# EAGLE design CFA_T_4L (EAGLE 9.4.2)
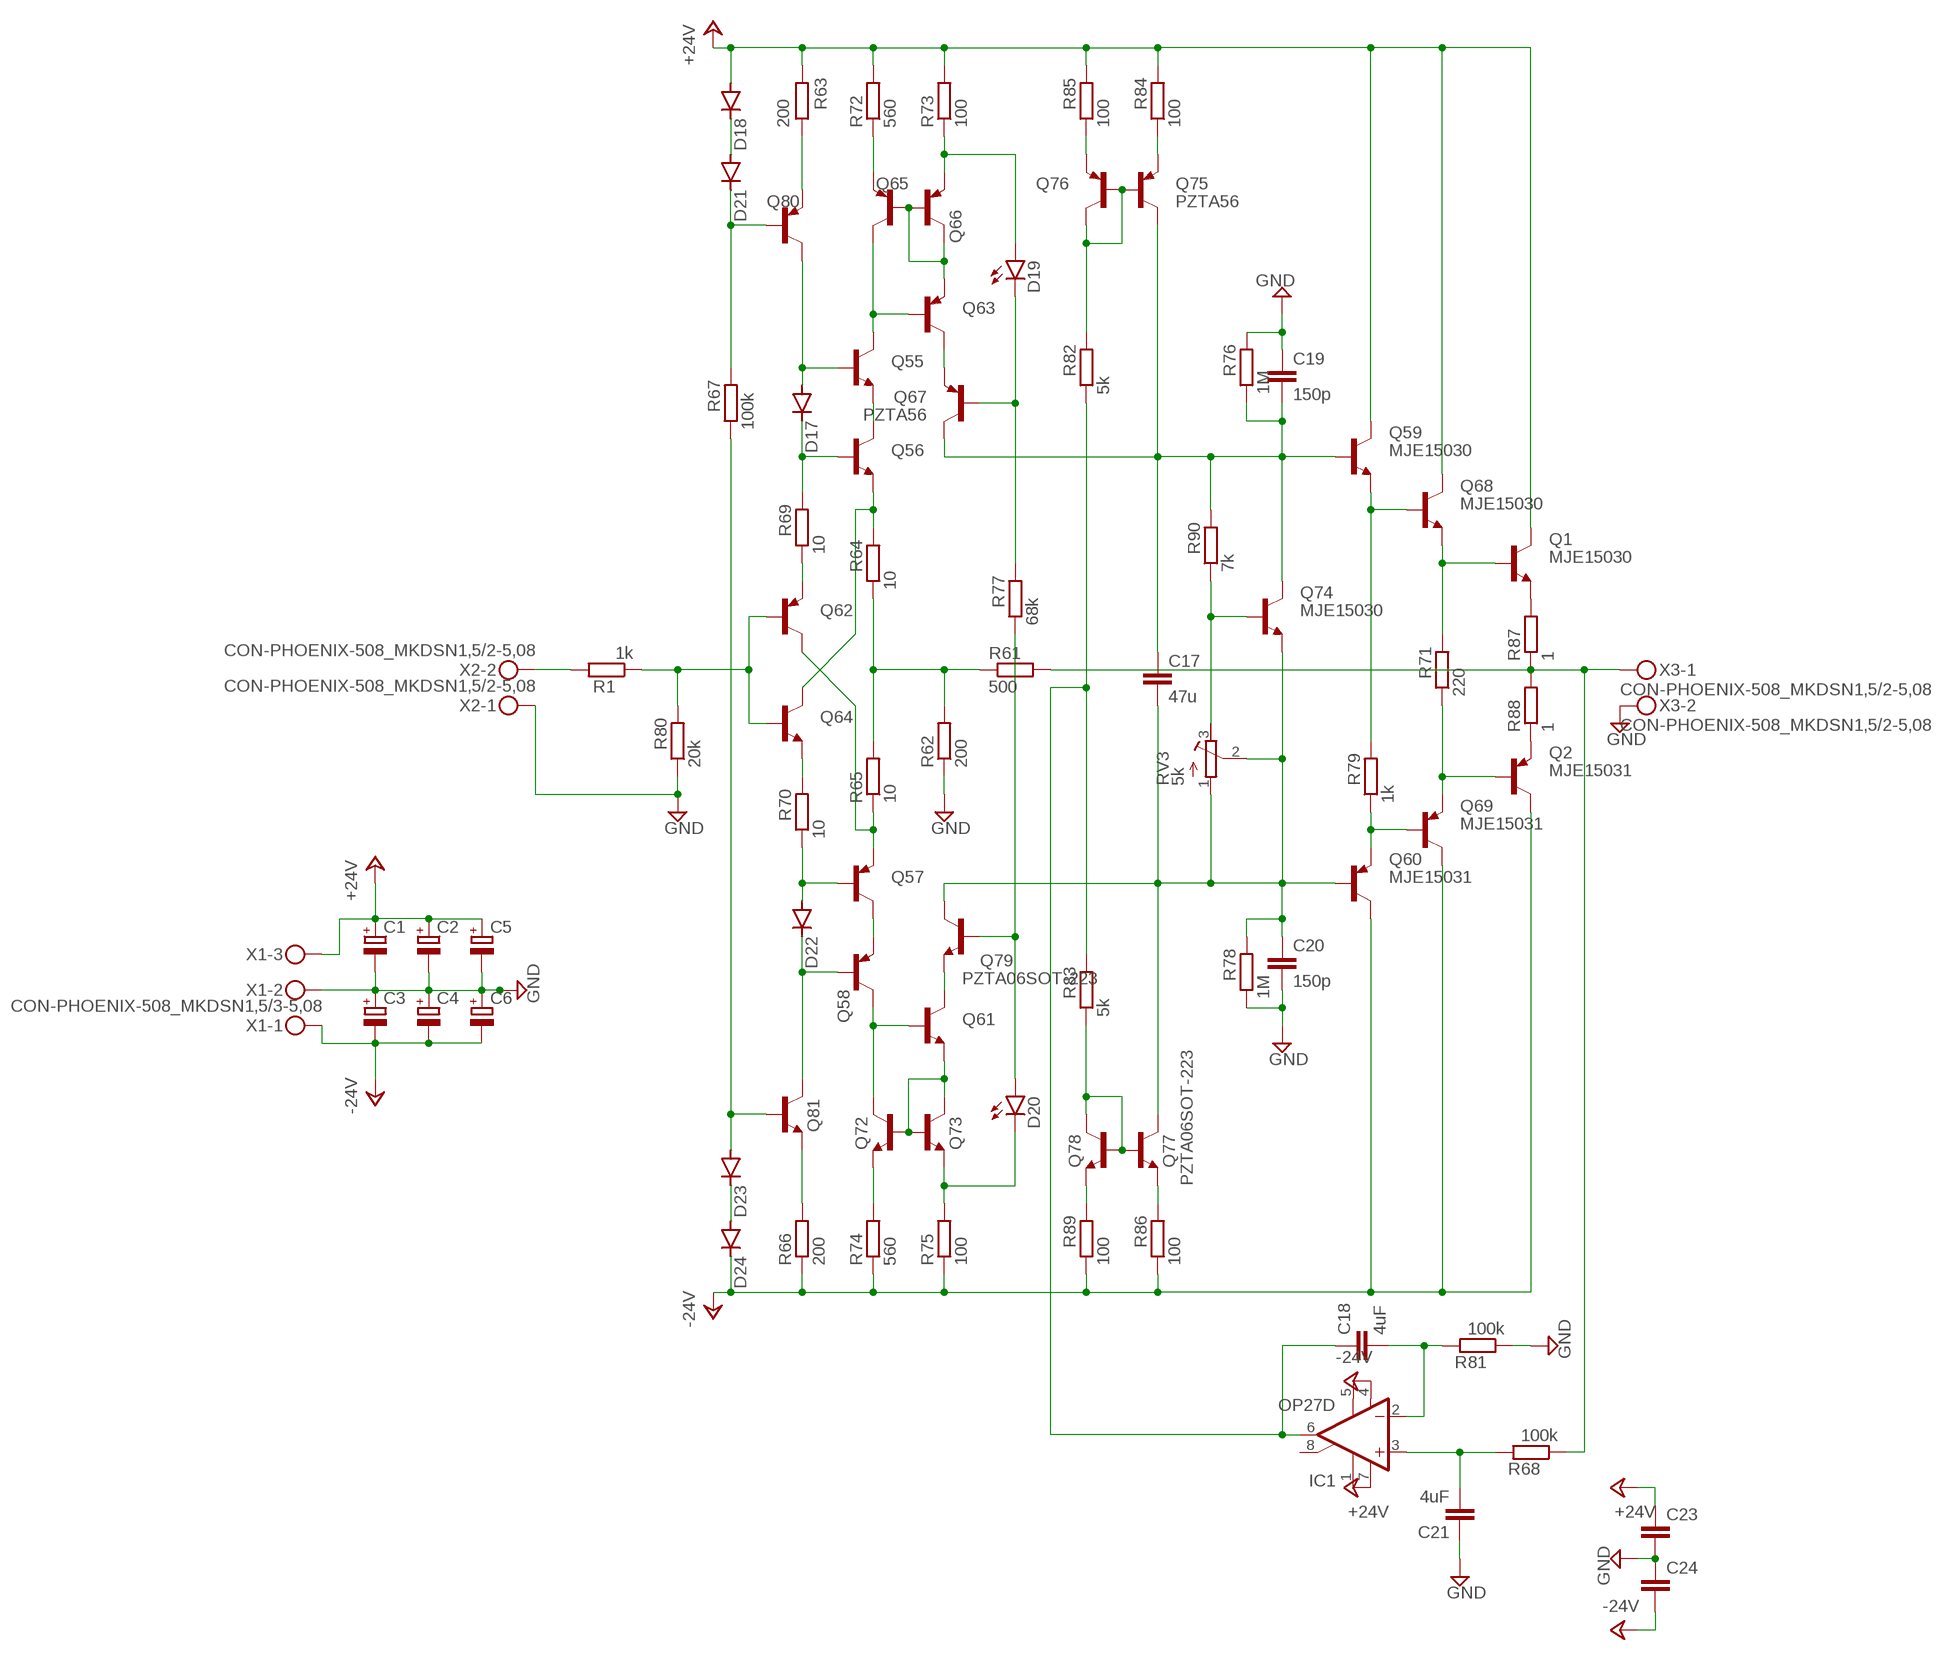
[diagram p0: schematic, sheet 1]

## Parts
C1  CPOL-EUE3.5-8  [E3,5-8]
C2  CPOL-EUE3.5-8  [E3,5-8]
C3  CPOL-EUE3.5-8  [E3,5-8]
C4  CPOL-EUE3.5-8  [E3,5-8]
C5  CPOL-EUE3.5-8  [E3,5-8]
C6  CPOL-EUE3.5-8  [E3,5-8]
C17  47u  C-EUC1210  [C1210]
C18  4uF  C-EUC1210  [C1210]
C19  150p  C-EUC0805  [C0805]
C20  150p  C-EUC0805  [C0805]
C21  4uF  C-EUC1210  [C1210]
C23  C-EUC0603K  [C0603K]
C24  C-EUC0603K  [C0603K]
D17  DIODE-SOD80C  [SOD80C]
D18  DIODE-SOD80C  [SOD80C]
D19  LED3MM  [LED3MM]
D20  LED3MM  [LED3MM]
D21  DIODE-SOD80C  [SOD80C]
D22  DIODE-SOD80C  [SOD80C]
D23  DIODE-SOD80C  [SOD80C]
D24  DIODE-SOD80C  [SOD80C]
IC1  OP27D  [SO08]
Q1  MJE15030  TRANSISTOR_MJE15030  [TRANSISTOR_TO220KG]
Q2  MJE15031  TRANSISTOR_MJE15031  [TRANSISTOR_TO220KG]
Q55  TRANSISTOR_BC850-NPN-SOT23-BEC  [TRANSISTOR_SOT23-BEC]
Q56  TRANSISTOR_BC850-NPN-SOT23-BEC  [TRANSISTOR_SOT23-BEC]
Q57  TRANSISTOR_BC857C-PNP-SOT23-BEC  [TRANSISTOR_SOT23-BEC]
Q58  TRANSISTOR_BC857C-PNP-SOT23-BEC  [TRANSISTOR_SOT23-BEC]
Q59  MJE15030  TRANSISTOR_MJE15030  [TRANSISTOR_TO220KG]
Q60  MJE15031  TRANSISTOR_MJE15031  [TRANSISTOR_TO220KG]
Q61  TRANSISTOR_BC847-NPN-SOT23-BEC  [TRANSISTOR_SOT23-BEC]
Q62  TRANSISTOR_BC857C-PNP-SOT23-BEC  [TRANSISTOR_SOT23-BEC]
Q63  TRANSISTOR_BC857C-PNP-SOT23-BEC  [TRANSISTOR_SOT23-BEC]
Q64  TRANSISTOR_BC850-NPN-SOT23-BEC  [TRANSISTOR_SOT23-BEC]
Q65  TRANSISTOR_BC857C-PNP-SOT23-BEC  [TRANSISTOR_SOT23-BEC]
Q66  TRANSISTOR_BC857C-PNP-SOT23-BEC  [TRANSISTOR_SOT23-BEC]
Q67  PZTA56  [SOT223]
Q68  MJE15030  TRANSISTOR_MJE15030  [TRANSISTOR_TO220KG]
Q69  MJE15031  TRANSISTOR_MJE15031  [TRANSISTOR_TO220KG]
Q72  TRANSISTOR_BC850-NPN-SOT23-BEC  [TRANSISTOR_SOT23-BEC]
Q73  TRANSISTOR_BC850-NPN-SOT23-BEC  [TRANSISTOR_SOT23-BEC]
Q74  MJE15030  TRANSISTOR_MJE15030  [TRANSISTOR_TO220KG]
Q75  PZTA56  [SOT223]
Q76  TRANSISTOR_BC857C-PNP-SOT23-BEC  [TRANSISTOR_SOT23-BEC]
Q77  PZTA06SOT-223  [SOT223]
Q78  TRANSISTOR_BC850-NPN-SOT23-BEC  [TRANSISTOR_SOT23-BEC]
Q79  PZTA06SOT-223  [SOT223]
Q80  TRANSISTOR_BC857C-PNP-SOT23-BEC  [TRANSISTOR_SOT23-BEC]
Q81  TRANSISTOR_BC850-NPN-SOT23-BEC  [TRANSISTOR_SOT23-BEC]
R1  1k  R-EU_MELF0204W  [MINI_MELF-0204W]
R61  500  R-EU_MELF0204W  [MINI_MELF-0204W]
R62  200  R-EU_MELF0204W  [MINI_MELF-0204W]
R63  200  R-EU_MELF0204W  [MINI_MELF-0204W]
R64  10  R-EU_MELF0204W  [MINI_MELF-0204W]
R65  10  R-EU_MELF0204W  [MINI_MELF-0204W]
R66  200  R-EU_MELF0204W  [MINI_MELF-0204W]
R67  100k  R-EU_MELF0204W  [MINI_MELF-0204W]
R68  100k  R-EU_MELF0204W  [MINI_MELF-0204W]
R69  10  R-EU_MELF0204W  [MINI_MELF-0204W]
R70  10  R-EU_MELF0204W  [MINI_MELF-0204W]
R71  220  R-EU_MELF0204W  [MINI_MELF-0204W]
R72  560  R-EU_MELF0204W  [MINI_MELF-0204W]
R73  100  R-EU_MELF0204W  [MINI_MELF-0204W]
R74  560  R-EU_MELF0204W  [MINI_MELF-0204W]
R75  100  R-EU_MELF0204W  [MINI_MELF-0204W]
R76  1M  R-EU_MELF0204W  [MINI_MELF-0204W]
R77  68k  R-EU_MELF0204W  [MINI_MELF-0204W]
R78  1M  R-EU_MELF0204W  [MINI_MELF-0204W]
R79  1k  R-EU_MELF0204W  [MINI_MELF-0204W]
R80  20k  R-EU_MELF0204W  [MINI_MELF-0204W]
R81  100k  R-EU_MELF0204W  [MINI_MELF-0204W]
R82  5k  R-EU_MELF0204W  [MINI_MELF-0204W]
R83  5k  R-EU_MELF0204W  [MINI_MELF-0204W]
R84  100  R-EU_MELF0204W  [MINI_MELF-0204W]
R85  100  R-EU_MELF0204W  [MINI_MELF-0204W]
R86  100  R-EU_MELF0204W  [MINI_MELF-0204W]
R87  1  R-EU_TO220  [TO220-2]
R88  1  R-EU_TO220  [TO220-2]
R89  100  R-EU_MELF0204W  [MINI_MELF-0204W]
R90  7k  R-EU_MELF0204W  [MINI_MELF-0204W]
RV3  5k  R-TRIMM3296W  [RTRIM3296W]
X1  CON-PHOENIX-508_MKDSN1,5/3-5,08  [CON-PHOENIX-508_MKDSN1,5/3-5,08]
X2  CON-PHOENIX-508_MKDSN1,5/2-5,08  [CON-PHOENIX-508_MKDSN1,5/2-5,08]
X3  CON-PHOENIX-508_MKDSN1,5/2-5,08  [CON-PHOENIX-508_MKDSN1,5/2-5,08]

## Nets
+24V: C1.+ C2.+ C5.+ C23.1 D18.A IC1.7(V+) Q1.2(C) Q59.2(C) Q68.2(C) R63.2 R72.2 R73.2 R84.2 R85.2 X1.3
-24V: C3.- C4.- C6.- C24.2 D24.C IC1.4(V-) Q2.2(C) Q60.2(C) Q69.2(C) R66.1 R74.1 R75.1 R86.1 R89.1 X1.1
GND: C1.- C2.- C3.+ C4.+ C5.- C6.+ C19.1 C20.2 C21.1 C23.2 C24.1 R62.1 R76.2 R78.1 R80.1 R81.1 X1.2 X2.1 X3.2
N$1: C17.2 C20.1 Q60.1(B) Q74.3(E) Q77.2(C) Q77.4(C) Q79.2(C) Q79.4(C) R78.2 RV3.1(A) RV3.2(S)
N$2: Q74.1(B) R90.1 RV3.3(E)
N$3: R1.2 X2.2
N$4: Q1.3(E) R87.2
N$5: Q2.3(E) R88.1
N$183: Q80.E R63.1
N$184: D17.A Q55.B Q80.C
N$185: D18.C D21.A
N$186: D21.C Q80.B R67.2
N$187: D17.C Q56.B R69.2
N$188: Q55.E Q56.C
N$189: Q56.E Q64.C R64.2
N$190: R61.1 R62.2 R64.1 R65.2
N$191: Q57.E Q62.C R65.1
N$192: D22.A Q57.B R70.1
N$193: D22.C Q58.B Q81.C
N$194: Q81.E R66.2
N$195: D23.C D24.A
N$196: Q57.C Q58.E
N$197: Q62.E R69.1
N$198: Q64.E R70.2
N$199: Q62.B Q64.B R1.1 R80.2
N$200: Q55.C Q63.B Q65.C
N$201: Q63.E Q65.B Q66.B Q66.C
N$202: Q65.E R72.1
N$203: D19.A Q66.E R73.1
N$204: Q63.C Q67.3(E)
N$205: D19.K(C) Q67.1(B) R77.2
N$206: Q61.E Q72.B Q73.B Q73.C
N$207: D20.K(C) Q73.E R75.2
N$208: Q72.E R74.2
N$209: Q58.C Q61.B Q72.C
N$210: Q61.C Q79.3(E)
N$211: D20.A Q79.1(B) R77.1
N$212: C17.1 C19.2 Q59.1(B) Q67.2(C) Q67.4(C) Q74.2(C) Q75.2(C) Q75.4(C) R76.1 R90.2
N$213: Q75.1(B) Q76.B Q76.C R82.2
N$214: Q77.1(B) Q78.B Q78.C R83.1
N$215: Q76.E R85.1
N$216: Q75.3(E) R84.1
N$218: R61.2 R68.1 R87.1 R88.2 X3.1
N$219: Q78.E R89.2
N$220: Q77.3(E) R86.2
N$221: Q59.3(E) Q68.1(B) R79.2
N$222: Q60.3(E) Q69.1(B) R79.1
N$224: Q1.1(B) Q68.3(E) R71.2
N$225: Q2.1(B) Q69.3(E) R71.1
N$228: C18.2 IC1.2(-IN) R81.2
N$229: C21.2 IC1.3(+IN) R68.2
N$230: D23.A Q81.B R67.1
N$232: C18.1 IC1.6(OUT) R82.1 R83.2
Unconnected: IC1.1(ON1) IC1.5(OPT) IC1.8(ON2)

## Library data of the parts
C1-C6 = Vwvwbg:CPOL-EU: POLARIZED CAPACITOR, European symbol
C17-C21 = Vwvwbg:C-EU: CAPACITOR, European symbol; SPICEPREFIX: C
C23 C24 = Vwvwbg:C-EU: CAPACITOR, European symbol
D17 D18 D21-D24 = diode:DIODE-: DIODE; SPICEPREFIX: D
D19 D20 = Vwvwbg:LED: LED OSRAM: - CHIPLED LG R971, LG N971, LY N971, LG Q971, LY Q971, LO R971, LY R971 LH N974, LH R974 LS Q976, LO Q976, LY Q976 LO Q996 - Hyper CHIPLED LW Q18S LB Q993, LB Q99A, LB R99A - SideLED LS A670, LO A670, LY A670, LG A670, LP A670 LB A673, LV A673, LT A673, LW A673 LH A674 LY A675 LS A676, LA A676, LO A676, LY A676, LW A676 LS A679, LY A679, LG A679 - Hyper Micro SIDELED® LS Y876, LA Y876, LO Y876, LY Y876 LT Y87S - SmartLED LW L88C, LW L88S LB L89C, LB L89S, LG L890 LS L89K, LO L89K, LY L89K LS L896, LA L896, LO L896, LY L896 - TOPLED LS T670, LO T670, LY T670, LG T670, LP T670 LSG T670, LSP T670, LSY T670, LOP T670, LYG T670 LG T671, LOG T671, LSG T671 LB T673, LV T673, LT T673, LW T673 LH T674 LS T676, LA T676, LO T676, LY T676, LB T676, LH T676, LSB T676, LW T676 LB T67C, LV T67C, LT T67C, LS T67K, LO T67K, LY T67K, LW E67C LS E67B, LA E67B, LO E67B, LY E67B, LB E67C, LV E67C, LT E67C LW T67C LS T679, LY T679, LG T679 LS T770, LO T770, LY T770, LG T770, LP T770 LB T773, LV T773, LT T773, LW T773 LH T774 LS E675, LA E675, LY E675, LS T675 LS T776, LA T776, LO T776, LY T776, LB T776 LHGB T686 LT T68C, LB T68C - Hyper Mini TOPLED® LB M676 - Mini TOPLED Santana® LG M470 LS M47K, LO M47K, LY M47K Source: http://www.osram.convergy.de LUXEON: - LUMILED® LXK2-PW12-R00, LXK2-PW12-S00, LXK2-PW14-U00, LXK2-PW14-V00 LXK2-PM12-R00, LXK2-PM12-S00, LXK2-PM14-U00 LXK2-PE12-Q00, LXK2-PE12-R00, LXK2-PE12-S00, LXK2-PE14-T00, LXK2-PE14-U00 LXK2-PB12-K00, LXK2-PB12-L00, LXK2-PB12-M00, LXK2-PB14-N00, LXK2-PB14-P00, LXK2-PB14-Q00 LXK2-PR12-L00, LXK2-PR12-M00, LXK2-PR14-Q00, LXK2-PR14-R00 LXK2-PD12-Q00, LXK2-PD12-R00, LXK2-PD12-S00 LXK2-PH12-R00, LXK2-PH12-S00 LXK2-PL12-P00, LXK2-PL12-Q00, LXK2-PL12-R00 Source: www.luxeon.com KINGBRIGHT: KA-3528ASYC Source: www.kingbright.com; SPICEPREFIX: D
IC1 = linear:OP27: OP AMP
Q1 Q59 Q68 Q74 = Vwvwbg:TRANSISTOR_MJE15030; SPICEPREFIX: Q
Q2 Q60 Q69 = Vwvwbg:TRANSISTOR_MJE15031; SPICEPREFIX: Q
Q55 Q56 Q61 Q64 Q72 Q73 Q78 Q81 = Vwvwbg:TRANSISTOR_*-NPN-: NPN Transistror BF959 corrected 2008.03.06; SPICEPREFIX: Q
Q57 Q58 Q62 Q63 Q65 Q66 Q76 Q80 = Vwvwbg:TRANSISTOR_*-PNP-: PNP Transistror; SPICEPREFIX: Q
Q67 Q75 = Vwvwbg:PZTA56; SPICEPREFIX: Q
Q77 Q79 = Vwvwbg:PZTA06; SPICEPREFIX: Q
R1 R61-R90 = Vwvwbg:R-EU_: RESISTOR, European symbol; SPICEPREFIX: R
RV3 = rcl_mod:R-TRIMM: Trimm resistor; SPICEMODEL: X; SPICEPREFIX: Z; SPICEPREFIXL: POT
X1 = Vwvwbg:CON-PHOENIX-508_MKDSN1,5/3-5,08: MKDSN 1,5/ 3-5,08 Printklemme Nennstrom: 13,5 A Nennspannung: 250 V Rastermaß: 5,08 mm Polzahl: 3 Anschlussart: Schraubanschluss Montage: Löten Anschlussrichtung Leiter/Platine: 0 ° Artikelnummer: 1729131 Source: http://eshop.phoenixcontact.com .. 1729131.pdf
X2 X3 = Vwvwbg:CON-PHOENIX-508_MKDSN1,5/2-5,08: MKDSN 1,5/ 2-5,08 Printklemme Nennstrom: 13,5 A Nennspannung: 250 V Rastermaß: 5,08 mm Polzahl: 2 Anschlussart: Schraubanschluss Montage: Löten Anschlussrichtung Leiter/Platine: 0 ° Artikelnummer: 1729128 Source: http://eshop.phoenixcontact.com .. 1729128.pdf

## Board
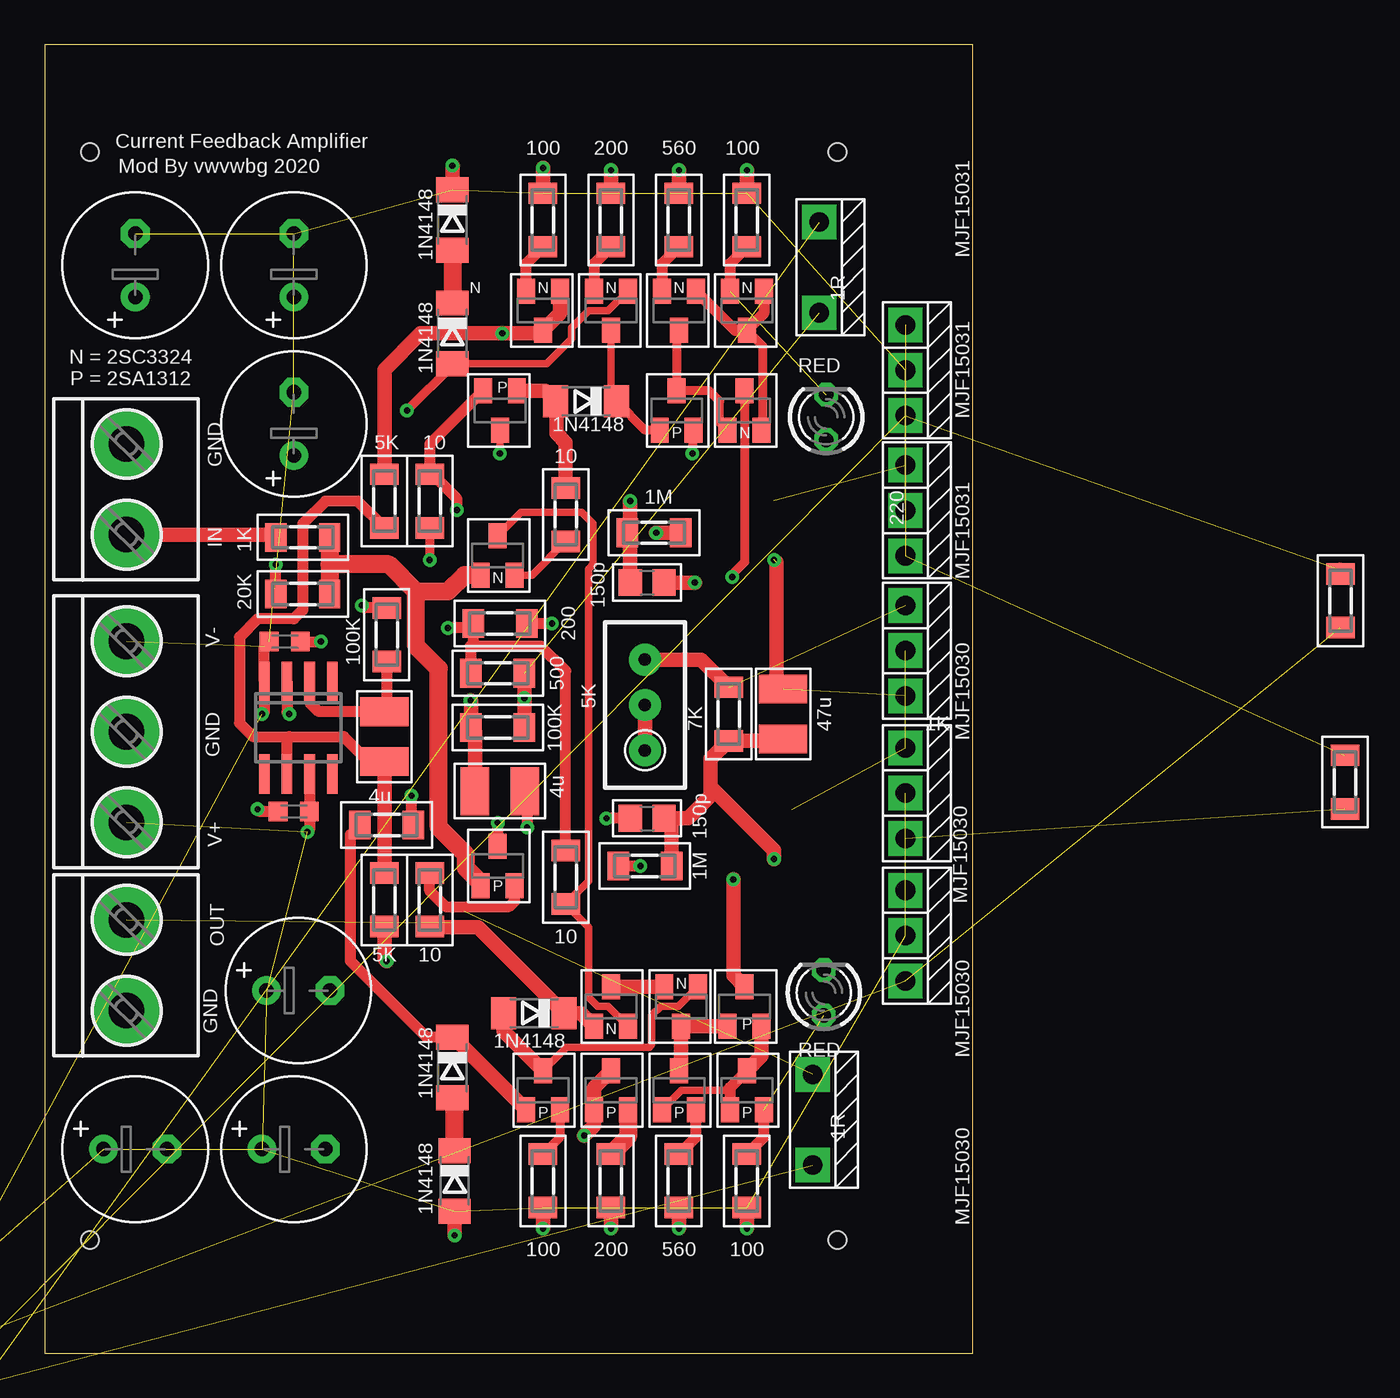
[diagram p1: board, top side]
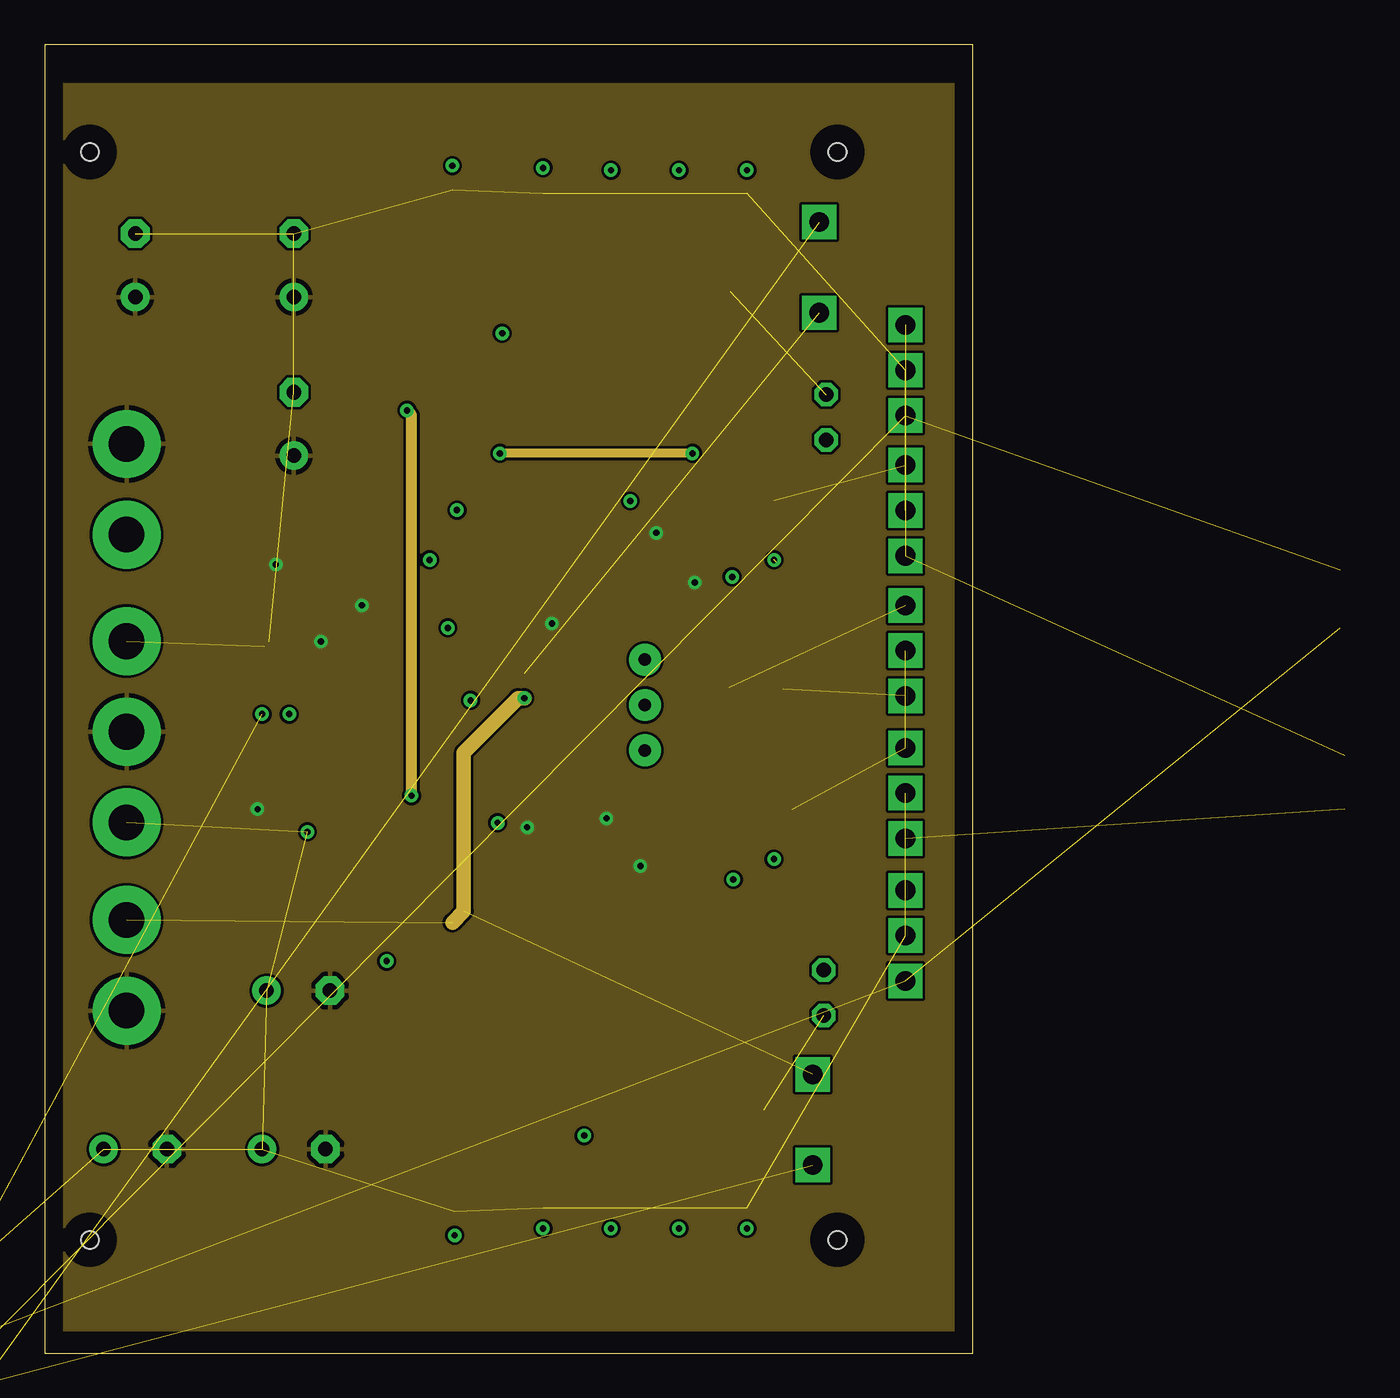
[diagram p2: board, inner layer Route2]
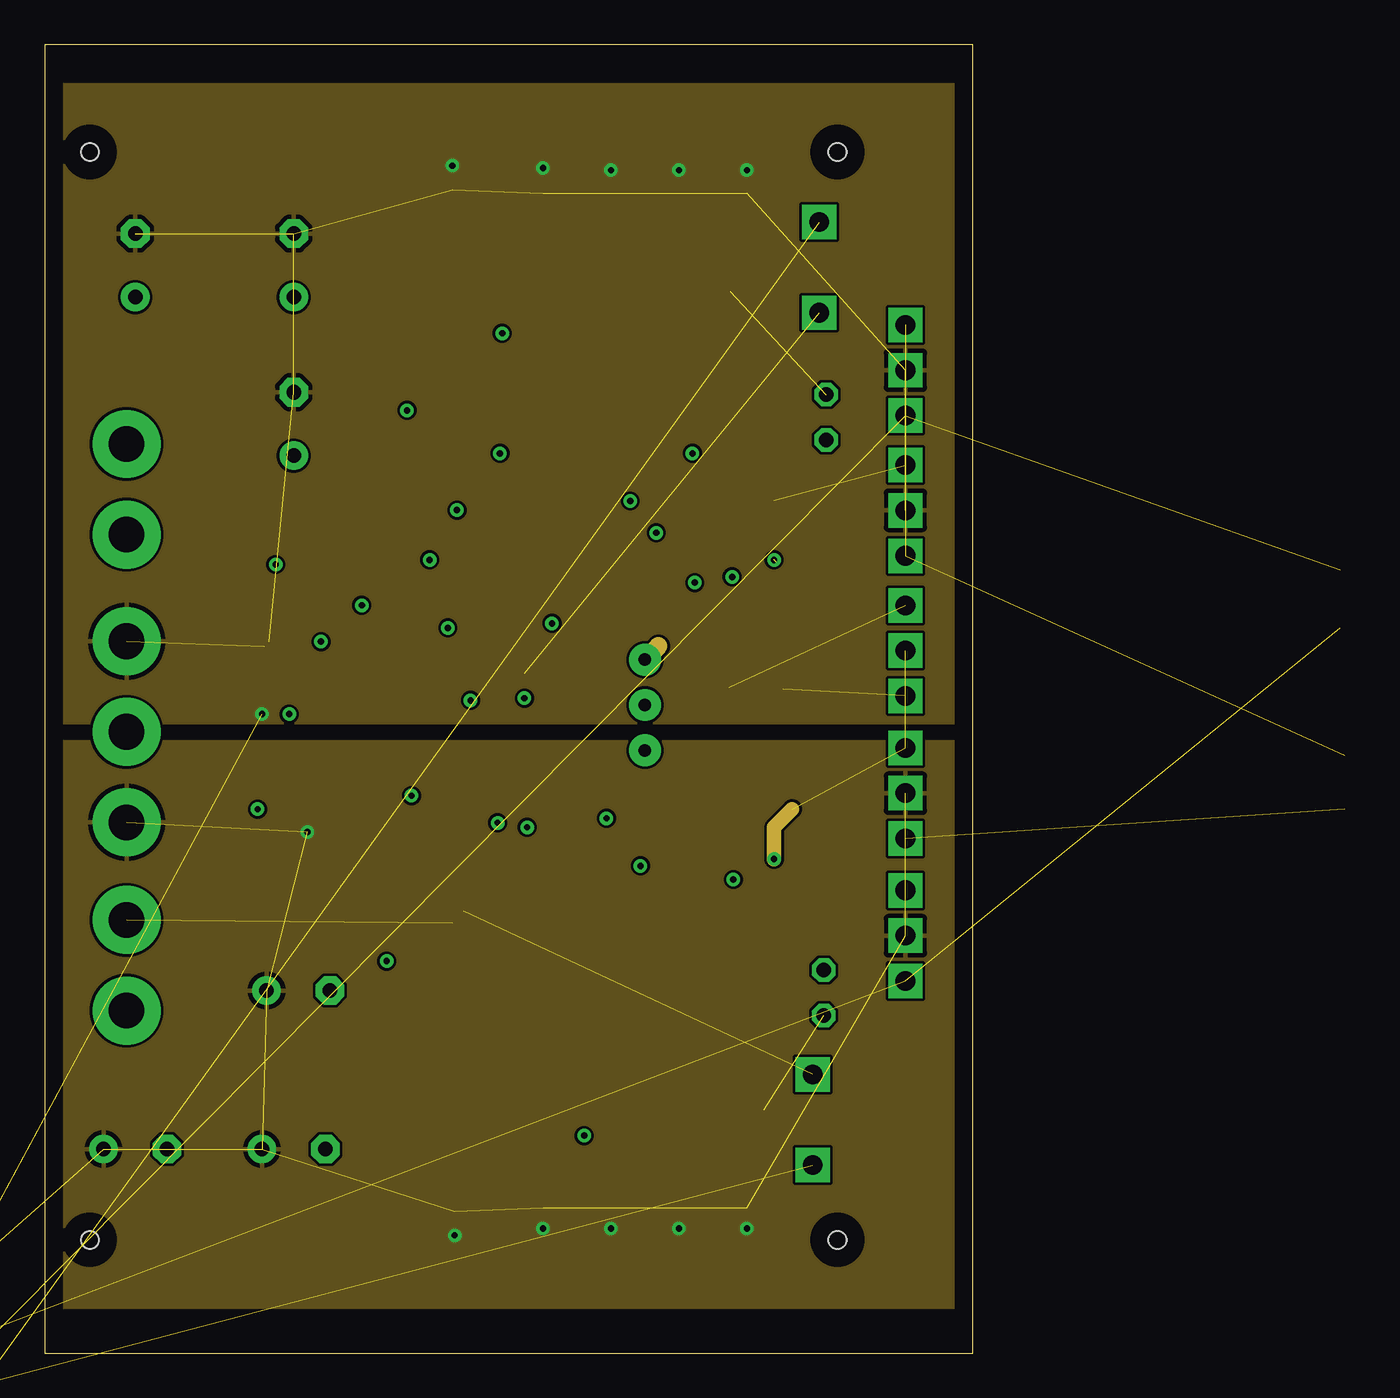
[diagram p3: board, inner layer Route15]
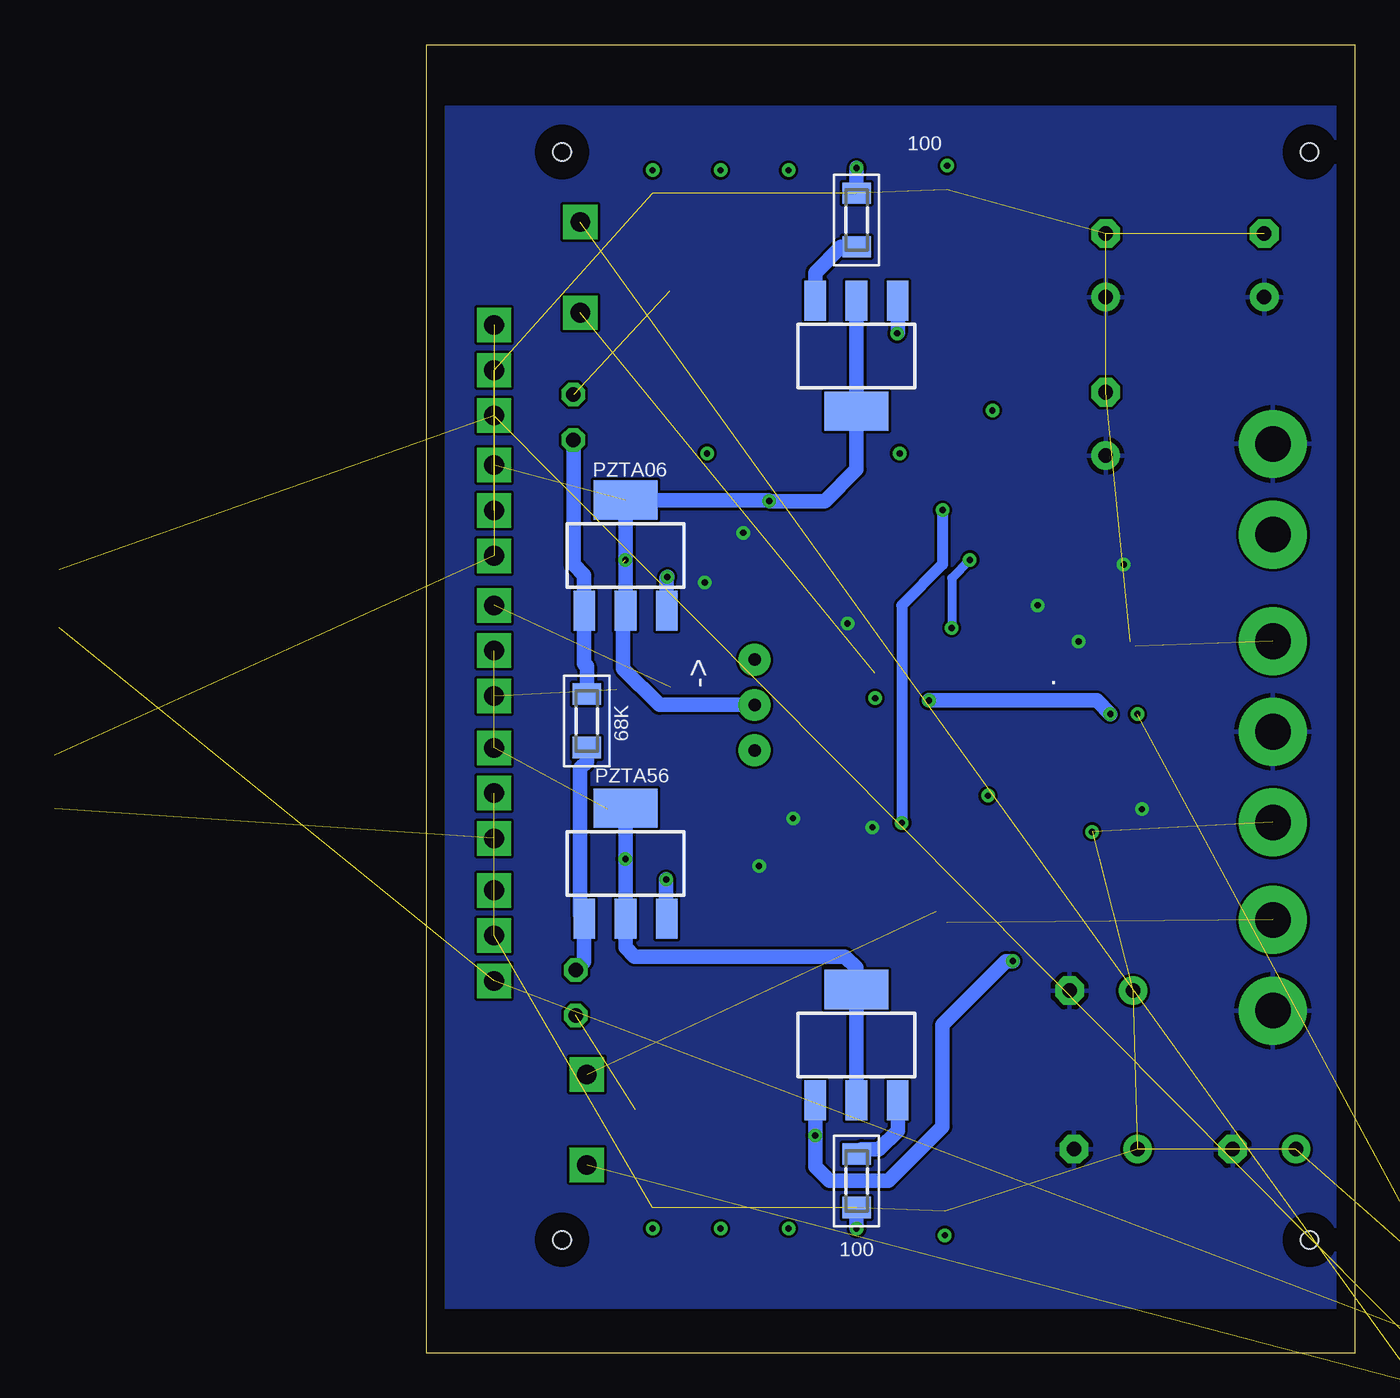
[diagram p4: board, bottom side, seen from below]

Size 52.05 x 73.33 mm. Coordinates in mm from the lower left corner, seen from the top.
Outline: 0,0 52.05,0 52.05,73.33 0,73.33 0,0
Copper layers (1+2*15+16): Top 0.035mm / dielectric 1.5mm / Route2 0.035mm / dielectric 0.15mm / Route15 0.035mm / dielectric 0.2mm / Bottom 0.035mm
Design rules "default *": minimum track width 6mil, minimum drill 0.35mm, track to track 6mil, track to pad 6mil, pad to pad 6mil, via to via 6mil, smd to smd 6mil, copper to edge 40mil, drill to drill 6mil, minimum pad ring 10mil, minimum via ring 8mil, stop-mask expansion 4mil, vias tented up to drill 0.35mm, thermal gap 10mil
Holes 1 mm at 2.54,67.31 44.45,67.31 44.45,6.35 2.54,6.35

### Footprints (pad centres in the part's own frame; a part is rotated, then mirrored left to right if it is on the bottom)
E3,5-8 = drill 0.813 pad 1.6: + -1.778,0 | drill 0.813 pad 1.6 octagon: - 1.778,0
C1210 = smd 1.6 x 2.7: 1 -1.4,0; 2 1.4,0
C0805 = smd 1.3 x 1.5: 1 -0.95,0; 2 0.95,0
C0603K = smd 1.05 x 1.08: 1 -0.875,0; 2 0.875,0
SOD80C = smd 1.4 x 1.8: A 1.7,0; C -1.7,0
LED3MM = drill 0.813 octagon: A -1.27,0; K 1.27,0
SO08 = smd 0.6 x 2.2: 1 -1.905,-2.6; 2 -0.635,-2.6; 3 0.635,-2.6; 4 1.905,-2.6; 5 1.905,2.6; 6 0.635,2.6; 7 -0.635,2.6; 8 -1.905,2.6
TRANSISTOR_TO220KG = drill 1.1 pad 1.93 square: 1 -2.54,0; 2 0,0; 3 2.54,0
TRANSISTOR_SOT23-BEC = smd 1 x 1.4: B -0.95,-1.1; C 0,1.1; E 0.95,-1.1
SOT223 = smd 1.219 x 2.235: 1 -2.311,-3.099; 2 0,-3.099; 3 2.311,-3.099 | smd 3.6 x 2.2: 4 0,3.099
MINI_MELF-0204W = smd 1.2 x 1.6: 1 -1.5,0; 2 1.5,0
TO220-2 = drill 1.1 pad 1.93 square: 1 -2.54,0; 2 2.54,0
RTRIM3296W = drill 0.7 pad 1.778: 1 0,-2.54; 2 0,0; 3 0,2.54
CON-PHOENIX-508_MKDSN1,5/3-5,08 = drill 2 pad 3.81: 1 -7.641,0.025; 2 -2.561,0.025; 3 2.519,0.025
CON-PHOENIX-508_MKDSN1,5/2-5,08 = drill 2 pad 3.81: 1 -2.561,0.025; 2 2.519,0.025

### Placement (x,y rotation side)
C1  14.22,20.32 0 top
C2  13.97,11.43 0 top
C3  13.97,52.07 90 top
C4  13.97,60.96 90 top
C5  5.08,11.43 0 top
C6  5.08,60.96 90 top
C17  41.4,35.81 90 top
C18  19.05,34.54 90 top
C19  33.78,29.97 0 top
C20  33.78,43.18 0 top
C21  25.53,31.5 180 top
C23  13.97,30.35 180 top
C24  13.46,39.88 180 top
D17  27.43,19.05 180 top
D18  22.99,9.65 270 top
D19  43.69,20.19 90 top
D20  43.81,52.45 90 top
D21  22.86,16 270 top
D22  30.35,53.34 180 top
D23  22.86,57.15 270 top
D24  22.86,63.5 270 top
IC1  14.22,35.05 180 top
Q1  -13.97,-3.81 0 top  (outside the outline)
Q2  -13.97,-12.7 0 top  (outside the outline)
Q55  35.69,19.43 180 top
Q56  31.75,19.43 0 top
Q57  25.53,52.83 180 top
Q58  35.43,52.83 0 top
Q59  48.26,31.38 270 top
Q60  48.26,47.22 270 top
Q61  39.24,52.83 0 top
Q62  25.4,27.3 0 top
Q63  39.24,19.43 0 top
Q64  25.4,44.7 0 top
Q65  35.56,14.73 0 top
Q66  39.37,14.73 0 top
Q67  40.89,27.43 0 bottom
Q68  48.26,23.4 270 top
Q69  48.26,55.08 270 top
Q72  35.56,58.42 180 top
Q73  39.37,58.42 180 top
Q74  48.26,39.37 270 top
Q75  27.94,17.27 0 bottom
Q76  31.75,14.73 0 top
Q77  27.94,55.88 180 bottom
Q78  27.94,58.42 180 top
Q79  40.89,44.7 0 bottom
Q80  27.94,14.73 0 top
Q81  31.75,58.42 180 top
R1  14.48,45.72 180 top
R61  25.4,38.1 0 top
R62  25.53,40.89 180 top
R63  27.94,9.65 270 top
R64  29.21,26.67 270 top
R65  21.59,47.75 270 top
R66  31.75,63.5 270 top
R67  19.18,29.59 180 top
R68  25.4,35.05 180 top
R69  21.59,25.4 270 top
R70  29.21,46.99 270 top
R71  72.64,42.16 270 top  (outside the outline)
R72  35.56,9.65 270 top
R73  39.37,9.65 270 top
R74  35.56,63.5 270 top
R75  39.37,63.5 270 top
R76  33.66,27.3 180 top
R77  43.05,35.43 270 bottom
R78  34.16,45.97 180 top
R79  72.9,32 270 top  (outside the outline)
R80  14.48,42.55 0 top
R81  19.18,40.26 270 top
R82  19.05,25.4 270 top
R83  19.05,47.75 270 top
R84  27.94,9.65 270 bottom
R85  31.75,9.65 270 top
R86  27.94,63.5 270 bottom
R87  43.05,13.08 270 top
R88  43.43,60.84 270 top
R89  27.94,63.5 270 top
R90  38.35,35.81 270 top
RV3  33.66,36.32 0 top
X1  4.57,32.26 270 top
X2  4.57,48.39 270 top
X3  4.57,21.72 270 top

### Tracks (layer width: path | path; a pad name or v marks a point on that pad's centre or on a via)
+24V  (via drill 0.35)  (12 unrouted)
  Top 0.61: IC1.7 14.86,30.37 C23.1 14.85,29.32 v14.73,29.21
  Top 0.813: D18.A v22.99,6.6 | v31.75,6.98 R85.2 | R72.2 v35.56,6.98 | R73.2 v39.37,6.98 | R84.2 v27.94,6.98
  Bottom 0.813: R84.2 v27.94,6.98
  pour Route15: -16.51,34.29 59.69,34.29 59.69,2.54 -16.51,2.54
-24V  (via drill 0.35)  (12 unrouted)
  Top 0.61: C24.2 12.32,39.61 IC1.4 12.32,35.94 v12.19,35.81
  Top 0.813: D24.C v22.86,66.55 | R86.1 v27.94,66.42 | R66.1 v31.75,66.29 | R74.1 v35.56,66.29 | R75.1 v39.37,66.29
  Bottom 0.813: R86.1 v27.94,66.42
  pour Route15: -20.32,35.31 58.42,35.31 58.42,71.12 -20.32,71.12
GND  (via drill 0.35)
  Top 0.508: C21.1 27.03,31.4
  Top 0.61: C23.2 12.06,30.35 v11.94,30.48 | C24.1 v15.49,39.88 | R81.1 17.93,41.76 v17.78,41.91 | R80.1 12.95,42.57 v12.95,44.2 | C19.1 v31.5,29.97 | R76.2 v33.4,27.3 | 27.03,31.4 27.05,31.37 v27.05,29.46 | R62.1 v28.45,40.89
  Top 0.813: C20.2 v36.45,43.18 | R78.1 v34.29,45.97
  pour Bottom: -7.62,69.85 53.34,69.85 53.34,2.54 -7.62,2.54
  pour Route2: -17.78,71.12 62.23,71.12 62.23,1.27 -17.78,1.27
N$1  (via drill 0.35)  (3 unrouted)
  Top 0.813: R78.2 32.83,46.14 v32.83,47.75 C20.1 | RV3.2 RV3.1 | C17.2 41.02,37.59 41.02,44.32
  Bottom 0.813: Q77.2 Q77.4 27.94,49.53 29.72,47.75 v32.83,47.75 32.88,47.8 Q79.4 v40.89,44.45 Q79.2 41.02,41.48 41.02,38.35 38.99,36.32 RV3.2
N$2  (1 unrouted)
  Top 0.813: R90.1 36.81,38.86 RV3.3
  Route15 1.016: 34.41,39.62 RV3.3
N$3
  Top 0.813: R1.2 12.83,45.87 X2.2
N$4  (1 unrouted)
N$5  (1 unrouted)
N$183
  Top 0.508: Q80.E 28.89,12.1 R63.1
N$184
  Top 0.406: Q55.B 35.54,19.43 34.54,19.43 34.04,18.92 34.04,17.27 33.91,17.14 29.25,17.14 Q80.C
  Top 0.813: Q80.C 25.73,18.04 D17.A
N$185
  Top 1.016: D18.C 22.99,14.18 D21.A
N$186
  Top 0.61: D21.C 21.41,17.7 17.15,21.97 17.15,29.06 R67.2
  Top 0.813: Q80.B 22.92,17.7 D21.C
N$187
  Top 0.813: R69.2 21.61,23.88 24.31,23.88 D17.C 30.08,19.05 Q56.B
N$188
  Top 0.406: 34.62,20.65 Q55.E
  Top 0.813: Q56.C 34.5,20.53 34.62,20.65
N$189
  Top 0.406: Q64.C 26.71,47.12 30.1,47.12 30.73,46.48 30.73,44.2 30.48,43.94 30.48,26.44 R64.2 29.21,25.15 30.48,23.88 30.48,19.94 30.99,19.43 31.6,19.43 Q56.E
N$190  (via drill 0.35)
  Top 0.508: R65.2 v21.59,44.45
  Top 0.61: R64.1 29.21,38.23 27.81,39.62 23.88,39.62 | 23.88,39.62 23.88,38.12 R61.1 | 23.88,39.62 24.03,39.78 R62.2 23.77,40.64 v22.61,40.64
  Bottom 0.508: v21.59,44.45 22.61,43.43 v22.61,40.64
N$191  (via drill 0.35)
  Top 0.61: Q57.E 21.59,50.95 R65.1 21.74,49.25 23.11,47.88 v23.11,47.24 | v25.4,29.72 Q62.C
  Bottom 0.61: v23.11,47.24 23.11,44.2 25.4,41.91 v25.4,29.72
N$192
  Top 0.813: R70.1 29.21,51.03 28.69,51.55 28.69,53.3 D22.A 28.06,53.93 Q57.B
N$193
  Top 0.406: D22.C 31.75,53.64 Q81.C
  Top 0.508: Q58.B 33.66,51.73 D22.C
N$194
  Top 0.61: R66.2 30.8,61.05 Q81.E
N$195
  Top 1.016: D24.A D23.C
N$196  (via drill 0.35)
  Top 0.406: Q57.C v25.53,50.42
  Top 0.508: v36.32,50.42 36.32,51.67 Q58.E
  Route2 0.508: v36.32,50.42 v25.53,50.42
N$197
  Top 0.61: R69.1 21.59,25.91 22.48,25.02 26.03,25.02 26.35,25.33 Q62.E
N$198
  Top 0.406: Q64.E 27.32,43.6 R70.2
N$199
  Top 0.508: Q62.B 24.45,26.35
  Top 0.813: 24.45,26.35 24.38,26.42
  Top 1.016: R1.1 15.98,44.2 | 15.98,44.2 R80.2 | 24.38,26.42 23.62,27.18 23.62,27.94 22.1,29.46 22.1,38.35 20.83,39.62 20.83,42.67 | 15.98,44.2 19.3,44.2 20.83,42.67 | Q64.B 23.54,43.6 22.61,42.67 20.83,42.67
N$200
  Top 0.813: Q65.C 35.69,15.96 Q55.C Q63.B
N$201
  Top 0.406: Q65.B 35.71,14.73 38.27,14.73 38.42,14.88
  Top 0.61: Q66.C 38.42,14.88 Q66.B
  Top 0.813: Q63.E 40.19,16.66 Q66.C
N$202
  Top 0.61: R72.1 36.51,12.1 Q65.E
N$203  (1 unrouted)
  Top 0.61: R73.1 40.32,12.1 Q66.E
N$204  (via drill 0.35)
  Top 0.813: Q63.C 38.61,21.17 v38.61,26.54
  Bottom 0.813: Q67.3 38.61,24.36 v38.61,26.54
N$205
  Bottom 0.813: R77.2 43.05,33.15 43.43,32.77 43.43,24.56 Q67.1 43.2,21.95 D19.K
N$206
  Top 0.508: Q61.E 40.26,51.8 40.26,56.43 Q73.C
  Top 0.61: Q73.B 40.32,58.27 Q73.C 38.71,57.32 Q72.B
N$207  (1 unrouted)
  Top 0.61: R75.2 38.42,61.05 Q73.E
N$208
  Top 0.61: R74.2 34.61,61.05 Q72.E
N$209
  Top 0.508: Q72.C 35.43,57.19 Q58.C 37.25,53.93 37.85,53.34 37.85,52.18 Q61.B
N$210  (via drill 0.35)
  Top 0.508: Q61.C 39.24,44.32 38.48,43.56 v38.55,43.5
  Bottom 0.813: Q79.3 38.58,43.46 v38.55,43.5
N$211
  Bottom 0.813: R77.1 43.05,38.48 43.2,38.63 Q79.1 43.2,43.59 43.81,44.2 D20.A
N$212  (via drill 0.35)  (2 unrouted)
  Top 0.813: C17.1 41.3,34.31 R90.2 37.34,33.3 37.34,31.75 | 37.34,31.75 37.34,31.24 36.07,29.97 35.18,29.97 | 35.18,29.97 C19.2 | R76.1 35.16,29.95 35.18,29.97 | 37.34,31.75 40.89,28.19 v40.89,27.69
  Route15 0.813: 41.91,30.48 40.89,29.46 v40.89,27.69
  Bottom 0.813: Q67.4 v40.89,27.69 Q67.2 40.89,22.73 40.39,22.22 28.57,22.22 27.94,21.59 Q75.4 Q75.2
N$213  (via drill 0.35)
  Top 0.813: v19.18,21.97 19.05,22.1 R82.2 | Q76.C 30.8,14.88 Q76.B 30.8,12.74 v30.25,12.19
  Bottom 0.813: Q75.1 v30.25,12.19 30.25,10.44 29.46,9.65 26.16,9.65 23.11,12.7 23.11,18.41 19.56,21.97 v19.18,21.97
N$214  (via drill 0.35)
  Top 0.813: Q78.B 28.89,58.27 Q78.C 27.77,57.15 v25.65,57.15 21.08,57.15 19.05,55.12 R83.1
  Bottom 0.813: Q77.1 25.63,57.18 v25.65,57.15
N$215
  Top 1.016: Q76.E 32.7,12.1 R85.1
N$216
  Bottom 0.813: R84.1 27.66,11.43 26.67,11.43 25.63,12.47 Q75.3
N$218  (via drill 0.35)  (3 unrouted)
  Top 0.813: R61.2 v26.9,36.7 R68.1
  Route2 0.813: 22.86,24.13 23.49,24.76 23.49,33.66 26.54,36.7 v26.9,36.7
N$219
  Top 0.61: R89.2 26.99,61.05 Q78.E
N$220
  Bottom 0.813: Q77.3 30.25,60.55 28.8,62 R86.2
N$221  (2 unrouted)
N$222  (2 unrouted)
N$224  (2 unrouted)
N$225  (2 unrouted)
  Top 0.813: 72.64,43.9 R71.1
N$228
  Top 0.61: R81.2 19.18,36.07 C18.2 15.36,35.94 14.86,36.45 IC1.2
N$229  (via drill 0.35)
  Top 0.61: IC1.3 13.59,35.94 v13.72,35.81
  Top 0.813: C21.2 24.13,34.83 R68.2 23.9,36.55 v23.88,36.58
  Bottom 0.813: v23.88,36.58 14.48,36.58 v13.72,35.81
N$230  (via drill 0.35)
  Top 0.406: D23.A 28.14,55.45 29.53,56.83 29.53,57.47 30.48,58.42 31.6,58.42 Q81.B
  Top 0.508: D23.A 22.86,55.37 v20.32,52.83
  Top 0.61: R67.1 20.57,29.69 v20.57,31.24
  Route2 0.61: v20.57,31.24 20.57,52.58 v20.32,52.83
N$232
  Top 0.61: R83.2 17.55,47.75 15.75,47.75 14.48,46.48 14.48,41.66 13.97,41.15 11.94,41.15 10.92,40.13 10.92,35.31 11.68,34.54 13.72,34.54 | C18.1 18.16,33.14 16.76,34.54 13.72,34.54 | IC1.6 13.59,34.42 13.72,34.54
  Top 0.813: C18.1 R82.1

### Text on the board
tPlace: Current Feedback Amplifier | 100 | 200 | 560 | 100 | Mod By vwvwbg 2020 | MJF15031 | 1N4148 | N | N | N | N | N | 1R | 1N4148 | RED | N = 2SC3324 / P = 2SA1312 | MJF15031 | P | 1N4148 | P | N | GND | 5K | 10 | 10 | 1M | 220 | IN | 1K | MJF15031 | N | 20K | 150p | 200 | V- | 100K | 500 | 5K | MJF15030 | 7K | 47u | GND | 100K | 1K | 4u | 4u | 150p | V+ | MJF15030 | 1M | P | OUT | 10 | 5K | 10 | N | GND | P | MJF15030 | 1N4148 | N | RED | 1N4148 | P | P | P | P | 1R | 1N4148 | MJF15030 | 100 | 200 | 560 | 100
bPlace: 100 | PZTA06 | . | -> | 68K | PZTA56 | 100